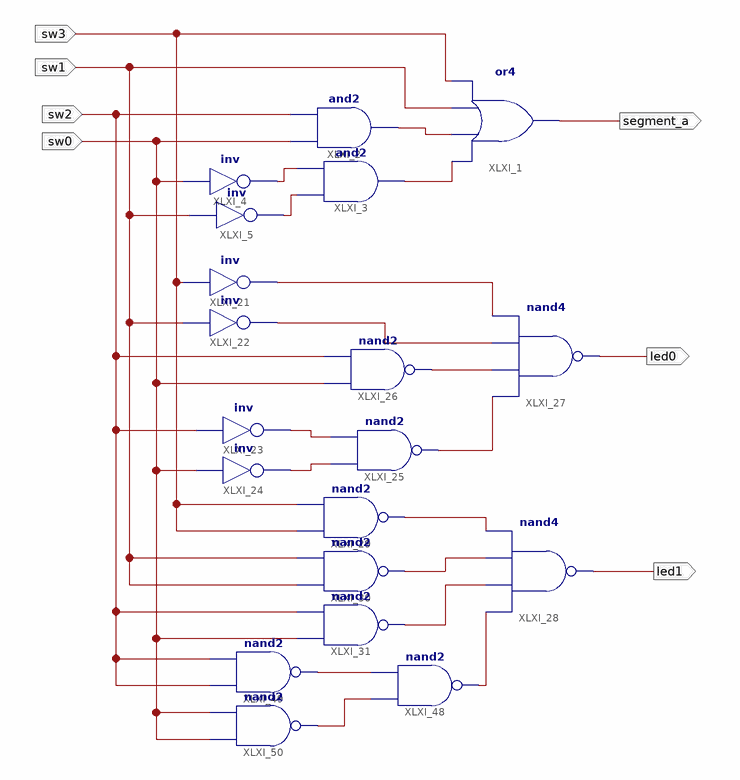
[diagram p0: schematic sheet 1]
// Xilinx ISE schematic lab4_2.sch (spartan3e) as structural Verilog: 19 symbols, 7 ports
module lab4_2 (
  input  sw3,
  input  sw1,
  input  sw0,
  input  sw2,
  output led0,
  output segment_a,
  output led1
);

  wire XLXN_1, XLXN_2, XLXN_3, XLXN_4, XLXN_35, XLXN_36, XLXN_37, XLXN_38, XLXN_39, XLXN_40, XLXN_60,
       XLXN_61, XLXN_62, XLXN_63, XLXN_64, XLXN_65;

  or XLXI_1 (segment_a, XLXN_2, XLXN_1, sw1, sw3);
  and XLXI_2 (XLXN_1, sw0, sw2);
  and XLXI_3 (XLXN_2, XLXN_4, XLXN_3);
  not XLXI_4 (XLXN_3, sw0);
  not XLXI_5 (XLXN_4, sw1);
  not XLXI_21 (XLXN_35, sw3);
  not XLXI_22 (XLXN_36, sw1);
  not XLXI_23 (XLXN_39, sw2);
  not XLXI_24 (XLXN_40, sw0);
  nand XLXI_25 (XLXN_38, XLXN_40, XLXN_39);
  nand XLXI_26 (XLXN_37, sw0, sw2);
  nand XLXI_27 (led0, XLXN_38, XLXN_37, XLXN_36, XLXN_35);
  nand XLXI_28 (led1, XLXN_63, XLXN_62, XLXN_61, XLXN_60);
  nand XLXI_29 (XLXN_60, sw3, sw3);
  nand XLXI_30 (XLXN_61, sw1, sw1);
  nand XLXI_31 (XLXN_62, sw0, sw2);
  nand XLXI_48 (XLXN_63, XLXN_65, XLXN_64);
  nand XLXI_49 (XLXN_64, sw2, sw2);
  nand XLXI_50 (XLXN_65, sw0, sw0);
endmodule
